# EAGLE schematic baseSchematicv2sch (EAGLE 9.6.2)
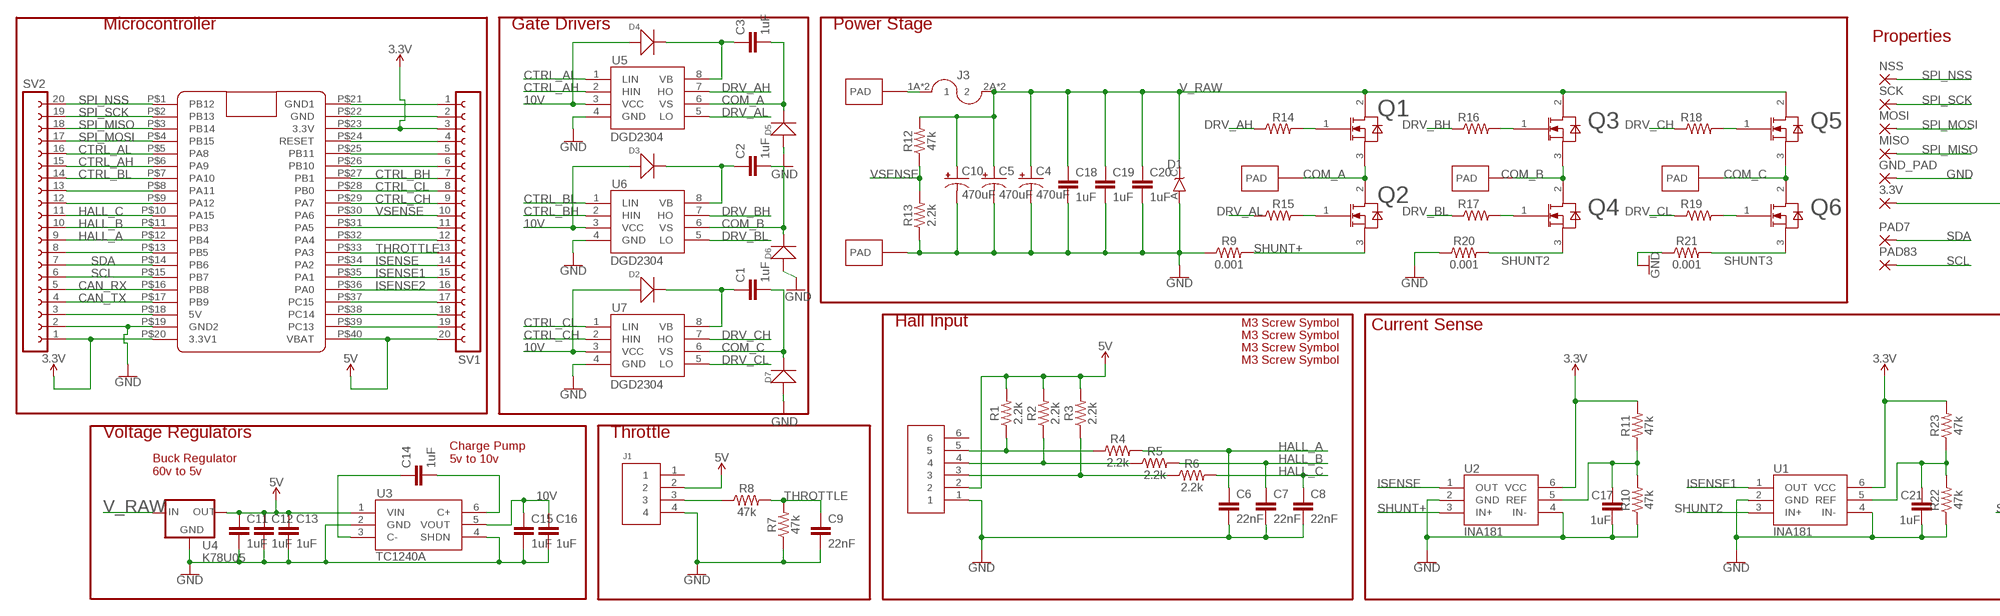
[diagram p0: schematic, sheet 1, part 1 of 2]
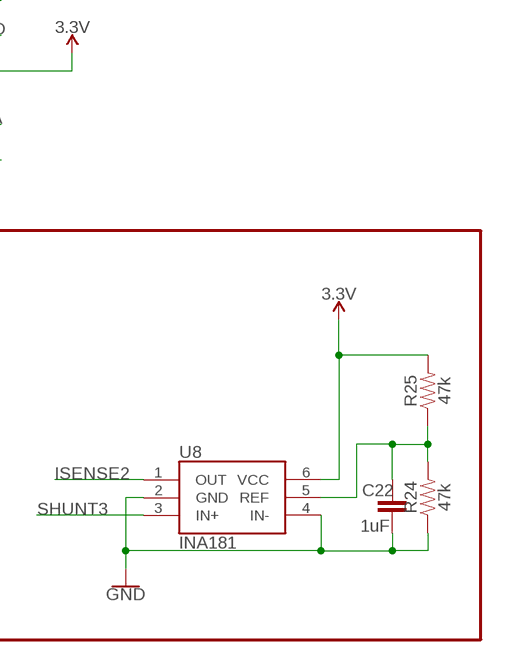
[diagram p1: schematic, sheet 1, part 2 of 2]

## Parts
3.3V  2,15/1,0  [2,15/1,0]
C1  1uF  1.0UF-1206-50V-10%  [1206]
C2  1uF  1.0UF-1206-50V-10%  [1206]
C3  1uF  1.0UF-1206-50V-10%  [1206]
C4  470uF  1000UF-RADIAL-5MM-25V-20%  [CPOL-RADIAL-5MM-10MM]
C5  470uF  1000UF-RADIAL-5MM-25V-20%  [CPOL-RADIAL-5MM-10MM]
C6  22nF  1.0UF-1206-50V-10%  [1206]
C7  22nF  1.0UF-1206-50V-10%  [1206]
C8  22nF  1.0UF-1206-50V-10%  [1206]
C9  22nF  1.0UF-1206-50V-10%  [1206]
C10  470uF  1000UF-RADIAL-5MM-25V-20%  [CPOL-RADIAL-5MM-10MM]
C11  1uF  1.0UF-1206-50V-10%  [1206]
C12  1uF  1.0UF-1206-50V-10%  [1206]
C13  1uF  1.0UF-1206-50V-10%  [1206]
C14  1uF  1.0UF-1206-50V-10%  [1206]
C15  1uF  1.0UF-1206-50V-10%  [1206]
C16  1uF  1.0UF-1206-50V-10%  [1206]
C17  1uF  1.0UF-1206-50V-10%  [1206]
C18  1uF  1.0UF-1206-50V-10%  [1206]
C19  1uF  1.0UF-1206-50V-10%  [1206]
C20  1uF  1.0UF-1206-50V-10%  [1206]
C21  1uF  1.0UF-1206-50V-10%  [1206]
C22  1uF  1.0UF-1206-50V-10%  [1206]
D1  TVS  TVS_UNIDO-214AC  [DO-214AC]
D2  SMD-DIODE-100V-200MA(SOD-123)  [SOD-123]
D3  SMD-DIODE-100V-200MA(SOD-123)  [SOD-123]
D4  SMD-DIODE-100V-200MA(SOD-123)  [SOD-123]
D5  SMD-DIODE-100V-200MA(SOD-123)  [SOD-123]
D6  SMD-DIODE-100V-200MA(SOD-123)  [SOD-123]
D7  SMD-DIODE-100V-200MA(SOD-123)  [SOD-123]
GND_PAD  2,15/1,0  [2,15/1,0]
J1  HEADER4VALULOK  [4PINVALULOK]
J2  HEADER6  [6PINVALULOK]
J3  FUSE  [AUTO_FUSE]
MISO  2,15/1,0  [2,15/1,0]
MOSI  2,15/1,0  [2,15/1,0]
NSS  2,15/1,0  [2,15/1,0]
PAD7  2,15/1,0  [2,15/1,0]
PAD83  2,15/1,0  [2,15/1,0]
Q1  IRF135S203  [TO254P1524X508-4_3N]
Q2  IRF135S203  [TO254P1524X508-4_3N]
Q3  IRF135S203  [TO254P1524X508-4_3N]
Q4  IRF135S203  [TO254P1524X508-4_3N]
Q5  IRF135S203  [TO254P1524X508-4_3N]
Q6  IRF135S203  [TO254P1524X508-4_3N]
R1  2.2k  RESISTOR1206  [1206]
R2  2.2k  RESISTOR1206  [1206]
R3  2.2k  RESISTOR1206  [1206]
R4  2.2k  RESISTOR1206  [1206]
R5  2.2k  RESISTOR1206  [1206]
R6  2.2k  RESISTOR1206  [1206]
R7  47k  RESISTOR1206  [1206]
R8  47k  RESISTOR1206  [1206]
R9  0.001  RESISTOR  [R2512]
R10  47k  RESISTOR1206  [1206]
R11  47k  RESISTOR1206  [1206]
R12  47k  RESISTOR1206  [1206]
R13  2.2k  RESISTOR1206  [1206]
R14  R-US_R1206  [R1206]
R15  R-US_R1206  [R1206]
R16  R-US_R1206  [R1206]
R17  R-US_R1206  [R1206]
R18  R-US_R1206  [R1206]
R19  R-US_R1206  [R1206]
R20  0.001  RESISTOR  [R2512]
R21  0.001  RESISTOR  [R2512]
R22  47k  RESISTOR1206  [1206]
R23  47k  RESISTOR1206  [1206]
R24  47k  RESISTOR1206  [1206]
R25  47k  RESISTOR1206  [1206]
SCK  2,15/1,0  [2,15/1,0]
SV1  FE20-1  [FE20]
SV2  FE20-1  [FE20]
U1  INA181  [SOT23-6]
U2  INA181  [SOT23-6]
U3  TC1240A  [SOT23-6]
U4  K78U05  V_REG_78XX  [V78W_BACKWARDS]
U5  DGD2304  [SOIC8]
U6  DGD2304  [SOIC8]
U7  DGD2304  [SOIC8]
U8  INA181  [SOT23-6]
U$1  BLUE_PILL  [BLUE_PILL]
U$4  PAD  [PAD]
U$5  PAD  [PAD]
U$6  PAD  [PAD]
U$7  PAD  [PAD]
U$8  PAD  [PAD]
U$10  SCREW  [M3HOLE]
U$11  SCREW  [M3HOLE]
U$12  SCREW  [M3HOLE]
U$13  SCREW  [M3HOLE]

## Nets
3.3V: 3.3V.1(P) R11.2 R23.2 R25.2 SV1.3 SV2.1 U1.6(VCC) U2.6(VCC) U8.6(VCC) U$1.P$20(3.3V1) U$1.P$23(3.3V)
5V: C11.1 C12.1 C13.1 J1.2 J2.2 R1.2 R2.2 R3.2 SV1.20 U3.1(VIN) U4.OUT U$1.P$40(VBAT)
10V: C15.1 C16.1 D2.+ D3.+ D4.+ U3.5(VOUT) U5.3(VCC) U6.3(VCC) U7.3(VCC)
CAN_RX: SV2.5 U$1.P$16(PB8)
CAN_TX: SV2.4 U$1.P$17(PB9)
COM_A: C3.2 D5.- Q1.3(SOURCE) Q2.2(DRAIN) U5.6(VS) U$6.PAD
COM_B: C2.2 D6.- Q3.3(SOURCE) Q4.2(DRAIN) U6.6(VS) U$7.PAD
COM_C: C1.2 D7.- Q5.3(SOURCE) Q6.2(DRAIN) U7.6(VS) U$8.PAD
CTRL_AH: SV2.15 U5.2(HIN) U$1.P$6(PA9)
CTRL_AL: SV2.16 U5.1(LIN) U$1.P$5(PA8)
CTRL_BH: SV1.7 U6.2(HIN) U$1.P$27(PB1)
CTRL_BL: SV2.14 U6.1(LIN) U$1.P$7(PA10)
CTRL_CH: SV1.9 U7.2(HIN) U$1.P$29(PA7)
CTRL_CL: SV1.8 U7.1(LIN) U$1.P$28(PB0)
DRV_AH: R14.1 U5.7(HO)
DRV_AL: R15.1 U5.5(LO)
DRV_BH: R16.1 U6.7(HO)
DRV_BL: R17.1 U6.5(LO)
DRV_CH: R18.1 U7.7(HO)
DRV_CL: R19.1 U7.5(LO)
GND: C4.- C5.- C6.2 C7.2 C8.2 C9.2 C10.- C11.2 C12.2 C13.2 C15.2 C16.2 C17.2 C18.2 C19.2 C20.2 C21.2 C22.2 D1.A D5.+ D6.+ D7.+ GND_PAD.1(P) J1.4 J2.1 R7.1 R9.1 R10.1 R13.1 R20.1 R21.1 R22.1 R24.1 SV2.2 U1.2(GND) U1.4(IN-) U2.2(GND) U2.4(IN-) U3.2(GND) U3.4(SHDN) U4.GND U5.4(GND) U6.4(GND) U7.4(GND) U8.2(GND) U8.4(IN-) U$1.P$19(GND2) U$5.PAD
HALL_A: C6.1 R4.2 SV2.9 U$1.P$12(PB4)
HALL_B: C7.1 R5.2 SV2.10 U$1.P$11(PB3)
HALL_C: C8.1 R6.2 SV2.11 U$1.P$10(PA15)
ISENSE: SV1.14 U2.1(OUT) U$1.P$34(PA2)
ISENSE1: SV1.15 U1.1(OUT) U$1.P$35(PA1)
ISENSE2: SV1.16 U8.1(OUT) U$1.P$36(PA0)
N$1: C2.1 D3.- U6.8(VB)
N$2: J2.3 R3.1 R6.1
N$3: C3.1 D4.- U5.8(VB)
N$4: J2.4 R2.1 R5.1
N$5: Q3.1(GATE) R16.2
N$6: J2.5 R1.1 R4.1
N$7: J1.3 R8.1
N$8: C1.1 D2.- U7.8(VB)
N$10: C17.1 R10.2 R11.1 U2.5(REF)
N$11: Q5.1(GATE) R18.2
N$12: Q1.1(GATE) R14.2
N$13: Q2.1(GATE) R15.2
N$14: Q4.1(GATE) R17.2
N$15: Q6.1(GATE) R19.2
N$18: C14.1 U3.3(C-)
N$19: C14.2 U3.6(C+)
N$21: SV2.13 U$1.P$8(PA11)
N$22: SV2.12 U$1.P$9(PA12)
N$23: SV2.8 U$1.P$13(PB5)
N$26: C21.1 R22.2 R23.1 U1.5(REF)
N$27: C22.1 R24.2 R25.1 U8.5(REF)
N$28: SV2.3 U$1.P$18(5V)
N$29: SV1.1 U$1.P$21(GND1)
N$31: SV1.2 U$1.P$22(GND)
N$32: SV1.4 U$1.P$24(RESET)
N$33: SV1.5 U$1.P$25(PB11)
N$34: SV1.6 U$1.P$26(PB10)
N$36: SV1.11 U$1.P$31(PA5)
N$38: SV1.19 U$1.P$39(PC13)
N$39: SV1.18 U$1.P$38(PC14)
N$40: SV1.17 U$1.P$37(PC15)
N$42: SV1.12 U$1.P$32(PA4)
SCL: PAD83.1(P) SV2.6 U$1.P$15(PB7)
SDA: PAD7.1(P) SV2.7 U$1.P$14(PB6)
SHUNT2: Q4.3(SOURCE) R20.2 U1.3(IN+)
SHUNT3: Q6.3(SOURCE) R21.2 U8.3(IN+)
SHUNT+: Q2.3(SOURCE) R9.2 U2.3(IN+)
SPI_MISO: MISO.1(P) SV2.18 U$1.P$3(PB14)
SPI_MOSI: MOSI.1(P) SV2.17 U$1.P$4(PB15)
SPI_NSS: NSS.1(P) SV2.20 U$1.P$1(PB12)
SPI_SCK: SCK.1(P) SV2.19 U$1.P$2(PB13)
THROTTLE: C9.1 R7.2 R8.2 SV1.13 U$1.P$33(PA3)
V_PREFUSE: J3.1A J3.1B U$4.PAD
V_RAW: C4.+ C5.+ C10.+ C18.1 C19.1 C20.1 D1.C J3.2A J3.2B Q1.2(DRAIN) Q3.2(DRAIN) Q5.2(DRAIN) R12.2 U4.IN
VSENSE: R12.1 R13.2 SV1.10 U$1.P$30(PA6)
Unconnected: J1.1 J2.6

## Notes on the sheet
- Microcontroller | Gate Drivers | Power Stage
- Properties
- Hall Input | Current Sense
- Voltage Regulators | Throttle
- Charge Pump
  5v to 10v
- Buck Regulator
  60v to 5v

## Library data of the parts
3.3V GND_PAD MISO MOSI NSS PAD7 PAD83 SCK = wirepad:2,15/1,0: THROUGH-HOLE PAD
C1-C3 C6-C9 C11-C22 = SparkFun-Capacitors:1.0UF: 1µF ceramic capacitors A capacitor is a passive two-terminal electrical component used to store electrical energy temporarily in an electric field.; PROD_ID: CAP-09822; VALUE: 1.0uF
C4 C5 C10 = SparkFun-Capacitors:1000UF: 1,000µF/1mF ceramic capacitors A capacitor is a passive two-terminal electrical component used to store electrical energy temporarily in an electric field. CAP-08070; PROD_ID: CAP-09538; VALUE: 1mF
D1 = 2018:TVS_UNI
D2-D7 = Seeed-Diode:SMD-DIODE-100V-200MA(SOD-123): 304010007; MPN: MMSD4148; VALUE: MMSD4148-sod123
J1 = Custom_old:HEADER4
J2 = Custom_old:HEADER6
J3 = Custom_old:FUSE
Q1-Q6 = IRF135S203:IRF135S203: IRF135S203 TO254P1524X508-4_3N Insulated-Gate Field-Effect Transistor (IGFET), N-Channel, Enhancement, Body Diode, Pin 1 Gate, 2 Drain, 3 Source, 3 Pins
R1-R8 R10-R13 R22-R25 = SparkFun-Resistors:RESISTOR: Generic Resistor Package
R9 R20 R21 = Custom_old:RESISTOR
R14-R19 = rcl:R-US_: RESISTOR, American symbol; SPICEPREFIX: R
SV1 SV2 = con-lsta:FE20-1: FEMALE HEADER; OC_FARNELL: unknown; OC_NEWARK: unknown
U1 U2 U8 = Custom_old:INA181
U3 = Custom_old:TC1240A
U4 = 2018:V_REG_78XX: Voltage Regulator Standard 7805 5V regulator. IGO (Input Ground Output). Spark Fun Electronics SKU : COM-00107
U5-U7 = Custom_old:DGD2304
U$1 = BluePill:BLUE_PILL
U$4-U$8 = Custom_old:PAD
U$10-U$13 = Custom_old:SCREW

## Net classes
0 default: clearance 0.205 mm